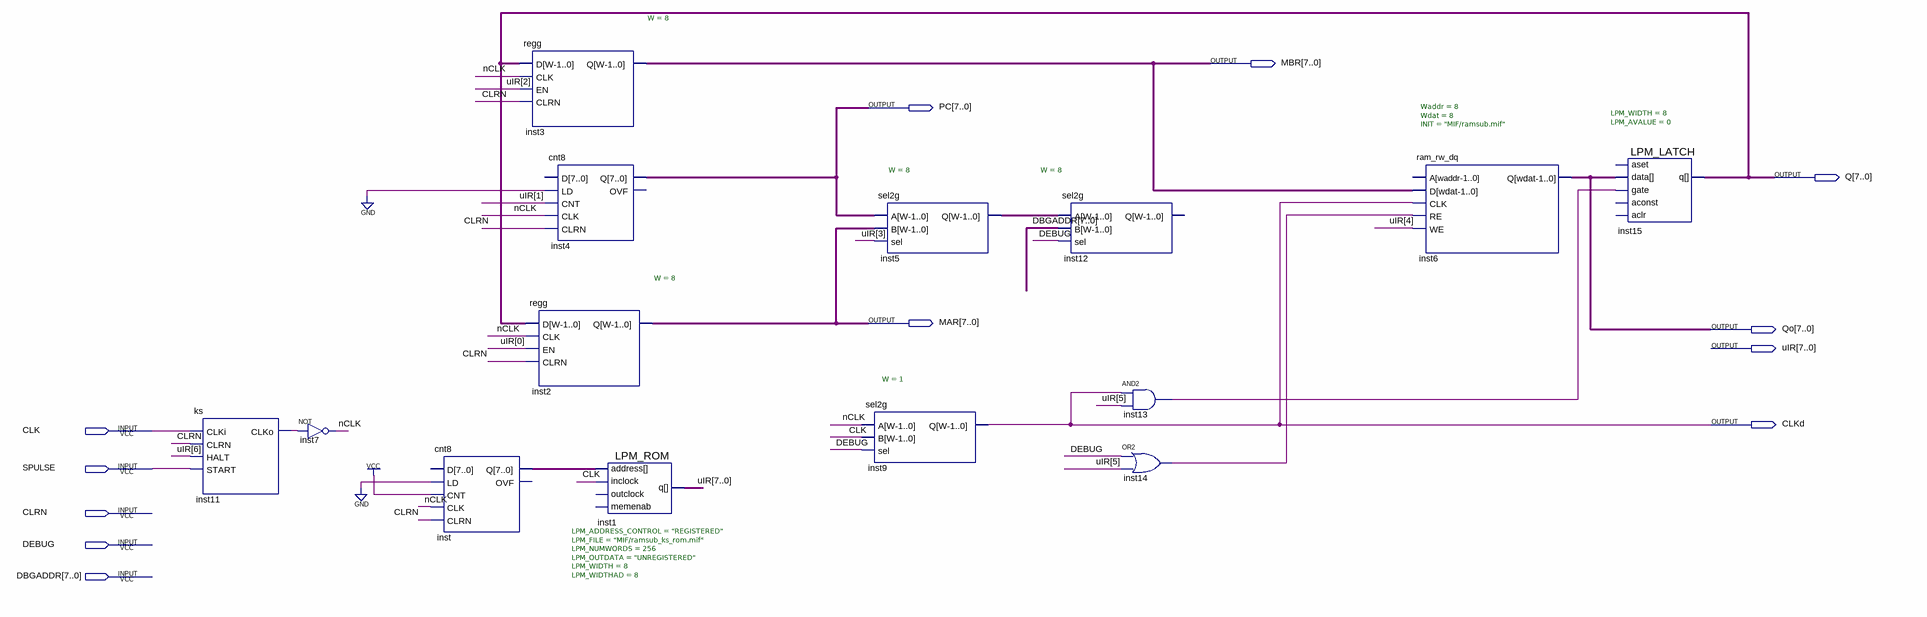
[diagram p0: schematic sheet]
// Quartus schematic ramsub_debug.bdf as structural Verilog: 14 symbols, 12 pins
module ramsub_debug (
  input  CLK,
  input  SPULSE,
  input  CLRN,
  input  DEBUG,
  input  [7:0] DBGADDR,
  output [7:0] MBR,
  output [7:0] PC,
  output [7:0] Q,
  output [7:0] MAR,
  output [7:0] Qo,
  output [7:0] uIR,
  output CLKd
);

  wire inst11_clko, inst13_out, inst14_out, nCLK;
  wire [7:0] inst5_q, inst_q;

  ks inst11 (.CLKi(CLK), .CLRN(CLRN), .HALT(uIR[6]), .START(SPULSE), .CLKo(inst11_clko));
  not inst7 (nCLK, inst11_clko);
  cnt8 inst (.LD(1'b0), .CNT(1'b1), .CLK(nCLK), .CLRN(CLRN), .Q(inst_q));  // open: D, OVF
  regg #(.W(8)) inst3 (.D(Q), .CLK(nCLK), .EN(uIR[2]), .CLRN(CLRN), .Q(MBR));
  cnt8 inst4 (.LD(1'b0), .CNT(uIR[1]), .CLK(nCLK), .CLRN(CLRN), .Q(PC));  // open: D, OVF
  regg #(.W(8)) inst2 (.D(Q), .CLK(nCLK), .EN(uIR[0]), .CLRN(CLRN), .Q(MAR));
  LPM_ROM #(.LPM_ADDRESS_CONTROL("REGISTERED"), .LPM_FILE("MIF/ramsub_ks_rom.mif"), .LPM_NUMWORDS(256), .LPM_OUTDATA("UNREGISTERED"), .LPM_WIDTH(8), .LPM_WIDTHAD(8)) inst1 (
    .address(inst_q), .inclock(CLK), .q(uIR));  // open: outclock, memenab
  sel2g #(.W(8)) inst5 (.A(PC), .B(MAR), .sel(uIR[3]), .Q(inst5_q));
  sel2g #(.W(1)) inst9 (.A(nCLK), .B(CLK), .sel(DEBUG), .Q(CLKd));
  sel2g #(.W(8)) inst12 (.A(inst5_q), .B(DBGADDR), .sel(DEBUG));  // open: Q
  and inst13 (inst13_out, CLKd, uIR[5]);
  or inst14 (inst14_out, DEBUG, uIR[5]);
  ram_rw_dq #(.Waddr(8), .Wdat(8), .INIT("MIF/ramsub.mif")) inst6 (
    .D(MBR), .CLK(CLKd), .RE(inst14_out), .WE(uIR[4]), .Q(Qo));  // open: A
  LPM_LATCH #(.LPM_WIDTH(8), .LPM_AVALUE(0)) inst15 (.data(Qo), .gate(inst13_out), .q(Q));  // open: aset, aconst, aclr
endmodule
